# Altium schematic sheet [04] Eeprom_Flash.SchDoc: EEPROM_FLASH
size A4
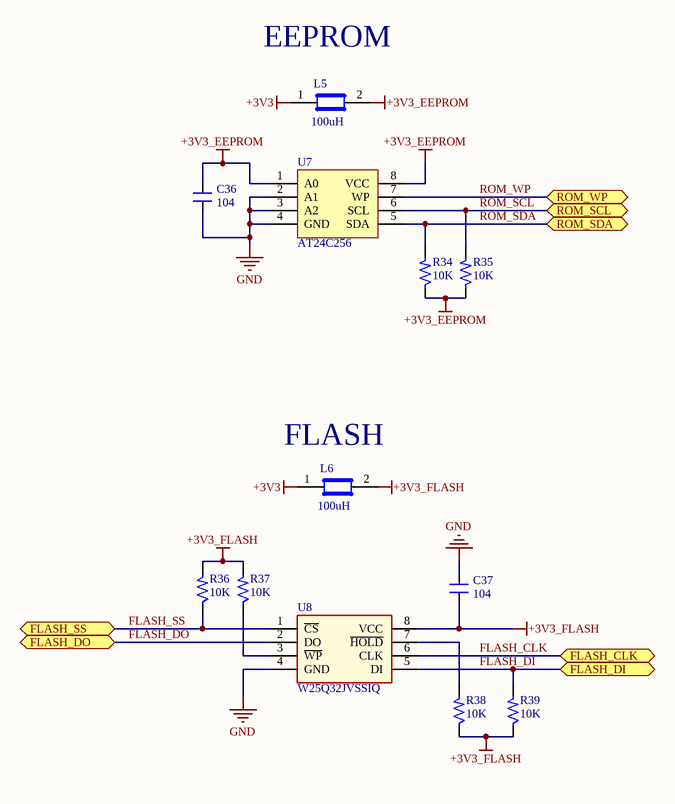
[diagram p0: [04] Eeprom_Flash.SchDoc]

## Parts
C36  104  [C0603 SMT]
C37  104  [C0603 SMT]
L5  100uH  [R0805]
L6  100uH  [R0805]
R34  10K  [R0603 -SMT]
R35  10K  [R0603 -SMT]
R36  10K  [R0603 -SMT]
R37  10K  [R0603 -SMT]
R38  10K  [R0603 -SMT]
R39  10K  [R0603 -SMT]
U7  AT24C256  [SO-8]
U8  W25Q32JVSSIQ  [SO-8 208]

## Ports
FLASH_CLK, FLASH_DI, FLASH_DO, FLASH_SS, ROM_SCL, ROM_SDA, ROM_WP

## Nets
+3V3: L5.1 L6.1
+3V3_EEPROM: C36.2 L5.2 R34.1 R35.1 U7.1(A0) U7.8(VCC)
+3V3_FLASH: C37.1 L6.2 R36.2 R37.2 R38.1 R39.1 U8.8(VCC)
GND: C36.1 C37.2 U7.2(A1) U7.3(A2) U7.4(GND) U8.4(GND)
FLASH_CLK: U8.6(CLK) ; port FLASH_CLK
FLASH_DI: R39.2 U8.5(DI) ; port FLASH_DI
FLASH_DO: U8.2(DO) ; port FLASH_DO
FLASH_SS: R36.1 U8.1(~{CS}) ; port FLASH_SS
ROM_SCL: R35.2 U7.6(SCL) ; port ROM_SCL
ROM_SDA: R34.2 U7.5(SDA) ; port ROM_SDA
ROM_WP: U7.7(WP) ; port ROM_WP
NetR37_1: R37.1 U8.3(~{WP})
NetR38_2: R38.2 U8.7(~{HOLD})

## Notes on the sheet
- (near L5) EEPROM
- (near L6) FLASH
- Title
- Size:
- Date:
- A4
- Number:
- Time:
- Revision:
- Sheet
- of
- File:

## Library data of the parts
C36 C37 = CM: Cap SMD; Value: 103
L5 L6 = Ferrite Bead: 100uH 0805
R34-R39 = RM: Resistor SMD; Value: 1K
U7 = AT24Cxx
U8 = W25Q32JV: FLASH 32MBIT 133MHZ 8SOP